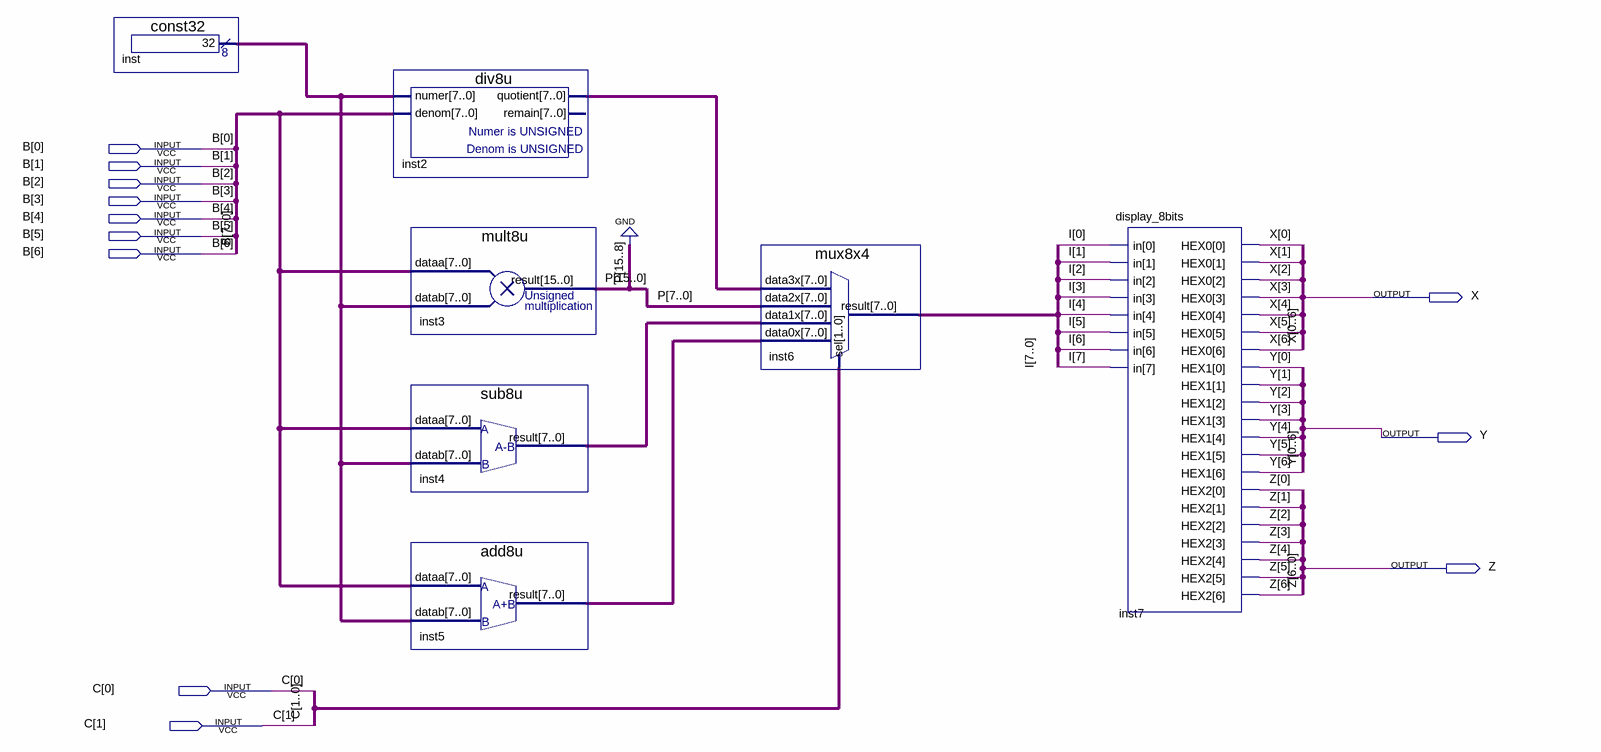
[diagram p0: schematic sheet]
// Quartus schematic alu_design (2022_05_22 18_19_10 UTC).bdf as structural Verilog: 7 symbols, 12 pins
module \alu_design_(2022_05_22_18_19_10_UTC)  (
  input  [7:0] B,
  input  [1:0] C,
  output X,
  output Y,
  output Z
);

  wire [6:0] X_bus, Y_bus, Z_bus;
  wire [7:0] I, inst2_quotient, inst4_result, inst5_result, inst_result;
  wire [15:0] P;

  const32 inst (.result(inst_result));
  div8u inst2 (.numer(inst_result), .denom(B), .quotient(inst2_quotient));  // open: remain
  mult8u inst3 (.dataa(B), .datab(inst_result), .result(P));
  sub8u inst4 (.dataa(B), .datab(inst_result), .result(inst4_result));
  add8u inst5 (.dataa(B), .datab(inst_result), .result(inst5_result));
  mux8x4 inst6 (
    .data3x(inst2_quotient), .data2x(P[7:0]), .data1x(inst4_result), .data0x(inst5_result), .sel(C),
    .result(I));
  display_8bits inst7 (.in(I), .HEX0(X_bus), .HEX1(Y_bus), .HEX2(Z_bus));
  // also tied to GND on the sheet: {P[8], P[9], P[10], P[11], P[12], P[13], P[14], P[15]}
endmodule
